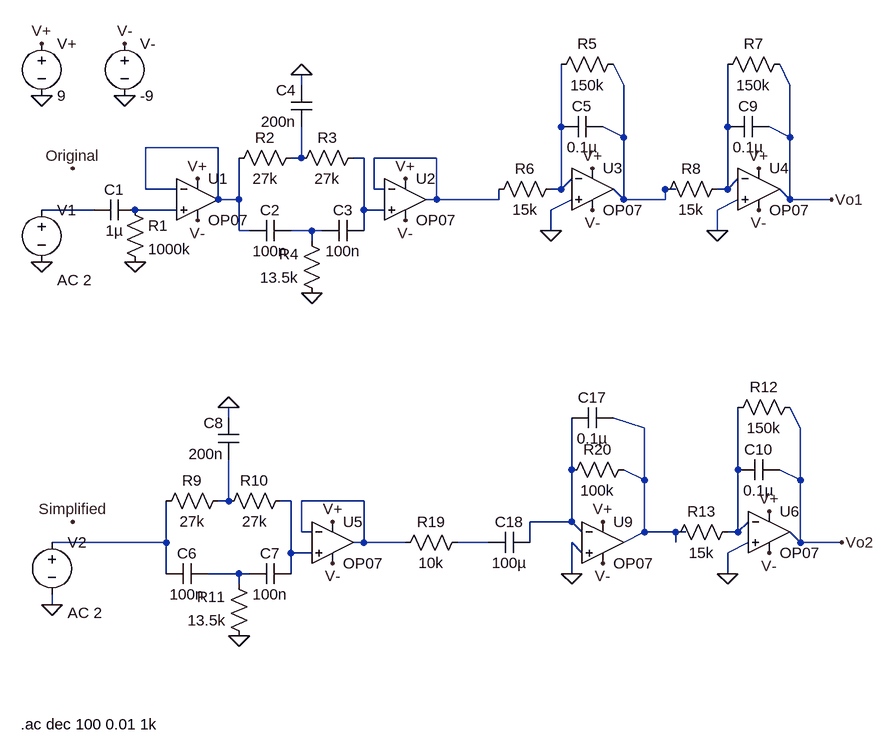
[diagram p0: schematic ECG_NormalandSimple.asc]
ECG_NormalandSimple.asc, the LTspice schematic file:
Version 4
SHEET 1 1032 872
WIRE 128 -128 128 -144
WIRE 624 -128 608 -160
WIRE 880 -128 864 -160
WIRE 528 -64 528 -160
WIRE 784 -64 784 -160
WIRE 624 -48 624 -128
WIRE 624 -48 592 -64
WIRE 880 -48 880 -128
WIRE 880 -48 848 -64
WIRE 0 -32 -112 -32
WIRE 128 -16 128 -64
WIRE 128 -16 112 -16
WIRE 224 -16 208 -16
WIRE 336 -16 240 -16
WIRE -112 32 -112 -32
WIRE -64 32 -112 32
WIRE 240 32 240 -16
WIRE 256 32 240 32
WIRE 528 32 528 -64
WIRE 528 32 544 16
WIRE 528 32 512 32
WIRE 704 32 688 32
WIRE 784 32 784 -64
WIRE 784 32 800 16
WIRE 784 32 768 32
WIRE 0 48 0 -32
WIRE 32 48 32 -16
WIRE 32 48 0 48
WIRE 336 48 336 -16
WIRE 336 48 320 48
WIRE 432 48 432 32
WIRE 432 48 336 48
WIRE 624 48 624 -48
WIRE 624 48 608 32
WIRE 688 48 688 32
WIRE 688 48 624 48
WIRE 880 48 880 -48
WIRE 880 48 864 32
WIRE 944 48 880 48
WIRE -192 64 -272 64
WIRE -64 64 -128 64
WIRE 224 64 224 -16
WIRE 256 64 224 64
WIRE 512 64 544 48
WIRE 768 64 800 48
WIRE 32 96 32 48
WIRE 48 96 32 96
WIRE 144 96 112 96
WIRE 160 96 144 96
WIRE 224 96 224 64
WIRE 512 96 512 64
WIRE 768 96 768 64
WIRE 144 112 144 96
WIRE 16 384 16 368
WIRE 656 400 608 384
WIRE 896 400 880 368
WIRE 544 464 544 384
WIRE 800 464 800 368
WIRE 656 480 656 400
WIRE 656 480 624 464
WIRE 896 480 896 400
WIRE 896 480 864 464
WIRE 16 512 16 448
WIRE 16 512 0 512
WIRE 112 512 96 512
WIRE 224 512 128 512
WIRE 544 544 544 464
WIRE 544 544 480 544
WIRE 128 560 128 512
WIRE 144 560 128 560
WIRE 560 560 544 544
WIRE 656 560 656 480
WIRE 704 560 656 560
WIRE 720 560 704 560
WIRE 800 560 800 464
WIRE 800 560 816 544
WIRE 800 560 784 560
WIRE -80 576 -80 512
WIRE -80 576 -256 576
WIRE 224 576 224 512
WIRE 224 576 208 576
WIRE 288 576 224 576
WIRE 416 576 368 576
WIRE 480 576 480 544
WIRE 624 576 656 560
WIRE 704 576 704 560
WIRE 896 576 896 480
WIRE 896 576 880 560
WIRE 960 576 896 576
WIRE 112 592 112 512
WIRE 144 592 112 592
WIRE 560 592 544 576
WIRE 784 592 816 576
WIRE -80 624 -80 576
WIRE 32 624 -16 624
WIRE 48 624 32 624
WIRE 112 624 112 592
WIRE 544 624 544 576
WIRE 784 624 784 592
WIRE 32 640 32 624
WIRE -256 672 -256 656
FLAG -272 -112 0
FLAG -144 -112 0
FLAG -272 -192 V+
FLAG -144 -192 V-
FLAG -272 144 0
FLAG -128 144 0
FLAG 128 -144 0
FLAG 144 192 0
FLAG 512 96 0
FLAG 16 368 0
FLAG 32 720 0
FLAG 544 624 0
FLAG -256 672 0
FLAG -32 16 V+
FLAG 288 16 V+
FLAG 576 0 V+
FLAG 176 544 V+
FLAG 592 544 V+
FLAG -32 80 V-
FLAG 288 80 V-
FLAG 576 64 V-
FLAG 592 608 V-
FLAG 176 608 V-
FLAG 768 96 0
FLAG 832 0 V+
FLAG 832 64 V-
FLAG 784 624 0
FLAG 848 528 V+
FLAG 848 592 V-
FLAG 944 48 Vo1
FLAG 960 576 Vo2
FLAG -224 0 Original
FLAG -224 544 Simplified
SYMBOL voltage -272 -208 R0
SYMATTR InstName V+
SYMATTR Value 9
SYMBOL voltage -144 -208 R0
SYMATTR InstName V-
SYMATTR Value -9
SYMBOL voltage -272 48 R0
WINDOW 123 24 124 Left 2
WINDOW 39 0 0 Left 0
SYMATTR Value2 AC 2
SYMATTR InstName V1
SYMATTR Value ""
SYMBOL voltage -256 560 R0
WINDOW 123 24 124 Left 2
WINDOW 39 0 0 Left 0
SYMATTR Value2 AC 2
SYMATTR InstName V2
SYMATTR Value ""
SYMBOL cap -128 48 R90
WINDOW 0 0 32 VBottom 2
WINDOW 3 32 32 VTop 2
SYMATTR InstName C1
SYMATTR Value 1µ
SYMBOL res -144 48 R0
SYMATTR InstName R1
SYMATTR Value 1000k
SYMBOL OpAmps\\OP07 -32 -16 R0
SYMATTR InstName U1
SYMBOL OpAmps\\OP07 288 -16 R0
SYMATTR InstName U2
SYMBOL OpAmps\\OP07 576 -32 R0
SYMATTR InstName U3
SYMBOL cap 112 80 R90
WINDOW 0 0 32 VBottom 2
WINDOW 3 32 32 VTop 2
SYMATTR InstName C2
SYMATTR Value 100n
SYMBOL cap 224 80 R90
WINDOW 0 0 32 VBottom 2
WINDOW 3 32 32 VTop 2
SYMATTR InstName C3
SYMATTR Value 100n
SYMBOL cap 144 -64 R180
WINDOW 0 24 56 Left 2
WINDOW 3 24 8 Left 2
SYMATTR InstName C4
SYMATTR Value 200n
SYMBOL cap 528 -48 R270
WINDOW 0 32 32 VTop 2
WINDOW 3 0 32 VBottom 2
SYMATTR InstName C5
SYMATTR Value 0.1µ
SYMBOL res 128 -32 R90
WINDOW 0 0 56 VBottom 2
WINDOW 3 32 56 VTop 2
SYMATTR InstName R2
SYMATTR Value 27k
SYMBOL res 224 -32 R90
WINDOW 0 0 56 VBottom 2
WINDOW 3 32 56 VTop 2
SYMATTR InstName R3
SYMATTR Value 27k
SYMBOL res 160 208 R180
WINDOW 0 36 76 Left 2
WINDOW 3 36 40 Left 2
SYMATTR InstName R4
SYMATTR Value 13.5k
SYMBOL res 512 -144 R270
WINDOW 0 32 56 VTop 2
WINDOW 3 0 56 VBottom 2
SYMATTR InstName R5
SYMATTR Value 150k
SYMBOL res 416 48 R270
WINDOW 0 32 56 VTop 2
WINDOW 3 0 56 VBottom 2
SYMATTR InstName R6
SYMATTR Value 15k
SYMBOL OpAmps\\OP07 176 512 R0
SYMATTR InstName U5
SYMBOL cap -16 608 R90
WINDOW 0 0 32 VBottom 2
WINDOW 3 32 32 VTop 2
SYMATTR InstName C6
SYMATTR Value 100n
SYMBOL cap 112 608 R90
WINDOW 0 0 32 VBottom 2
WINDOW 3 32 32 VTop 2
SYMATTR InstName C7
SYMATTR Value 100n
SYMBOL cap 32 448 R180
WINDOW 0 24 56 Left 2
WINDOW 3 24 8 Left 2
SYMATTR InstName C8
SYMATTR Value 200n
SYMBOL res 16 496 R90
WINDOW 0 0 56 VBottom 2
WINDOW 3 32 56 VTop 2
SYMATTR InstName R9
SYMATTR Value 27k
SYMBOL res 112 496 R90
WINDOW 0 0 56 VBottom 2
WINDOW 3 32 56 VTop 2
SYMATTR InstName R10
SYMATTR Value 27k
SYMBOL res 48 736 R180
WINDOW 0 36 76 Left 2
WINDOW 3 36 40 Left 2
SYMATTR InstName R11
SYMATTR Value 13.5k
SYMBOL OpAmps\\OP07 592 512 R0
SYMATTR InstName U9
SYMBOL res 384 560 R90
WINDOW 0 0 56 VBottom 2
WINDOW 3 32 56 VTop 2
SYMATTR InstName R19
SYMATTR Value 10k
SYMBOL res 640 448 R90
WINDOW 0 0 56 VBottom 2
WINDOW 3 32 56 VTop 2
SYMATTR InstName R20
SYMATTR Value 100k
SYMBOL cap 608 368 R90
WINDOW 0 0 32 VBottom 2
WINDOW 3 32 32 VTop 2
SYMATTR InstName C17
SYMATTR Value 0.1µ
SYMBOL cap 480 560 R90
WINDOW 0 0 32 VBottom 2
WINDOW 3 32 32 VTop 2
SYMATTR InstName C18
SYMATTR Value 100µ
SYMBOL OpAmps\\OP07 832 -32 R0
SYMATTR InstName U4
SYMBOL cap 784 -48 R270
WINDOW 0 32 32 VTop 2
WINDOW 3 0 32 VBottom 2
SYMATTR InstName C9
SYMATTR Value 0.1µ
SYMBOL res 768 -144 R270
WINDOW 0 32 56 VTop 2
WINDOW 3 0 56 VBottom 2
SYMATTR InstName R7
SYMATTR Value 150k
SYMBOL res 672 48 R270
WINDOW 0 32 56 VTop 2
WINDOW 3 0 56 VBottom 2
SYMATTR InstName R8
SYMATTR Value 15k
SYMBOL OpAmps\\OP07 848 496 R0
SYMATTR InstName U6
SYMBOL cap 800 480 R270
WINDOW 0 32 32 VTop 2
WINDOW 3 0 32 VBottom 2
SYMATTR InstName C10
SYMATTR Value 0.1µ
SYMBOL res 784 384 R270
WINDOW 0 32 56 VTop 2
WINDOW 3 0 56 VBottom 2
SYMATTR InstName R12
SYMATTR Value 150k
SYMBOL res 688 576 R270
WINDOW 0 32 56 VTop 2
WINDOW 3 0 56 VBottom 2
SYMATTR InstName R13
SYMATTR Value 15k
TEXT -304 856 Left 2 !.ac dec 100 0.01 1k

The netlist it stands for:
* ECG_NormalandSimple.asc
V+ V+ 0 9
V- V- 0 -9
V1 N008 0 AC 2
V2 N017 0 AC 2
C1 N009 N008 1µ
R1 N009 0 1000k
XU1 N009 N004 V+ V- N004 LT1001  ; OP07, pins In+ In- V+ V- OUT
XU2 N006 N007 V+ V- N007 LT1001  ; OP07, pins In+ In- V+ V- OUT
XU3 0 N002 V+ V- N001 LT1001  ; OP07, pins In+ In- V+ V- OUT
C2 N010 N004 100n
C3 N006 N010 100n
C4 N005 0 200n
C5 N002 N001 0.1µ
R2 N005 N004 27k
R3 N006 N005 27k
R4 0 N010 13.5k
R5 N002 N001 150k
R6 N007 N002 15k
XU5 N015 N016 V+ V- N016 LT1001  ; OP07, pins In+ In- V+ V- OUT
C6 N019 N017 100n
C7 N015 N019 100n
C8 N014 0 200n
R9 N014 N017 27k
R10 N015 N014 27k
R11 0 N019 13.5k
XU9 0 N012 V+ V- N011 LT1001  ; OP07, pins In+ In- V+ V- OUT
R19 N018 N016 10k
R20 N011 N012 100k
C17 N011 N012 0.1µ
C18 N012 N018 100µ
XU4 0 N003 V+ V- Vo1 LT1001  ; OP07, pins In+ In- V+ V- OUT
C9 N003 Vo1 0.1µ
R7 N003 Vo1 150k
R8 N001 N003 15k
XU6 0 N013 V+ V- Vo2 LT1001  ; OP07, pins In+ In- V+ V- OUT
C10 N013 Vo2 0.1µ
R12 N013 Vo2 150k
R13 N011 N013 15k
.ac dec 100 0.01 1k
.lib LTC.lib
.backanno
.end